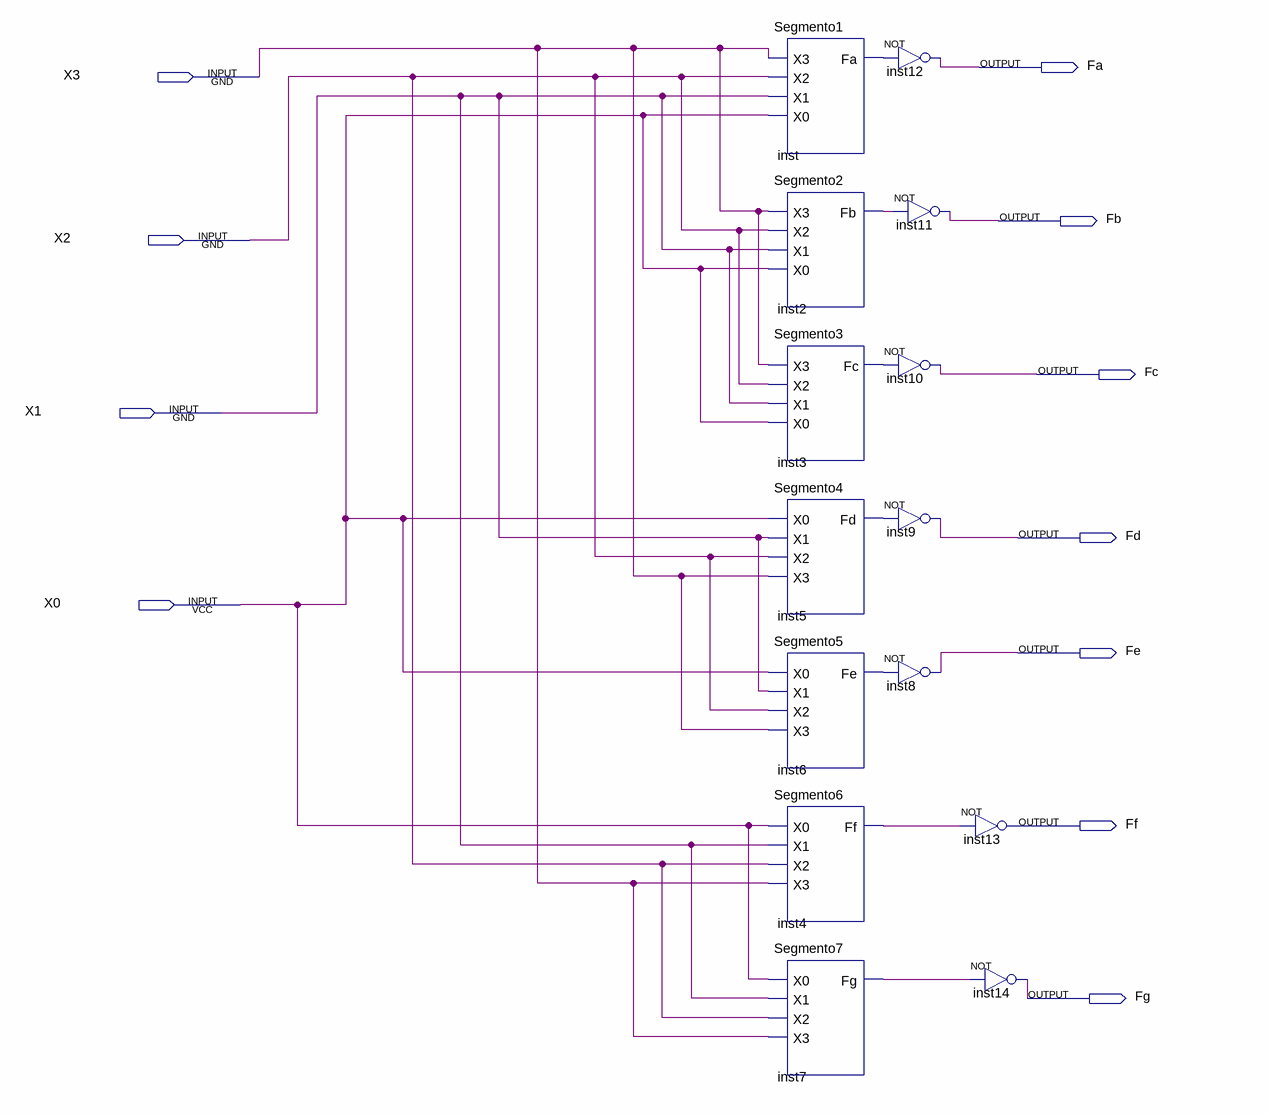
[diagram p0: schematic sheet]
// Quartus schematic HEX_7SEG.bdf as structural Verilog: 14 symbols, 11 pins
module HEX_7SEG (
  input  X3,
  input  X2,
  input  X1,
  input  X0,
  output Fa,
  output Fb,
  output Fc,
  output Fd,
  output Fe,
  output Ff,
  output Fg
);

  wire inst2_fb, inst3_fc, inst4_ff, inst5_fd, inst6_fe, inst7_fg, inst_fa;

  Segmento1 inst (.X3(X3), .X2(X2), .X1(X1), .X0(X0), .Fa(inst_fa));
  Segmento2 inst2 (.X3(X3), .X2(X2), .X1(X1), .X0(X0), .Fb(inst2_fb));
  Segmento3 inst3 (.X3(X3), .X2(X2), .X1(X1), .X0(X0), .Fc(inst3_fc));
  Segmento4 inst5 (.X0(X0), .X1(X1), .X2(X2), .X3(X3), .Fd(inst5_fd));
  Segmento5 inst6 (.X0(X0), .X1(X1), .X2(X2), .X3(X3), .Fe(inst6_fe));
  Segmento6 inst4 (.X0(X0), .X1(X1), .X2(X2), .X3(X3), .Ff(inst4_ff));
  Segmento7 inst7 (.X0(X0), .X1(X1), .X2(X2), .X3(X3), .Fg(inst7_fg));
  not inst12 (Fa, inst_fa);
  not inst10 (Fc, inst3_fc);
  not inst9 (Fd, inst5_fd);
  not inst8 (Fe, inst6_fe);
  not inst11 (Fb, inst2_fb);
  not inst13 (Ff, inst4_ff);
  not inst14 (Fg, inst7_fg);
endmodule
